# EAGLE design Eagle_TouchSensor (EAGLE 7.2.0)
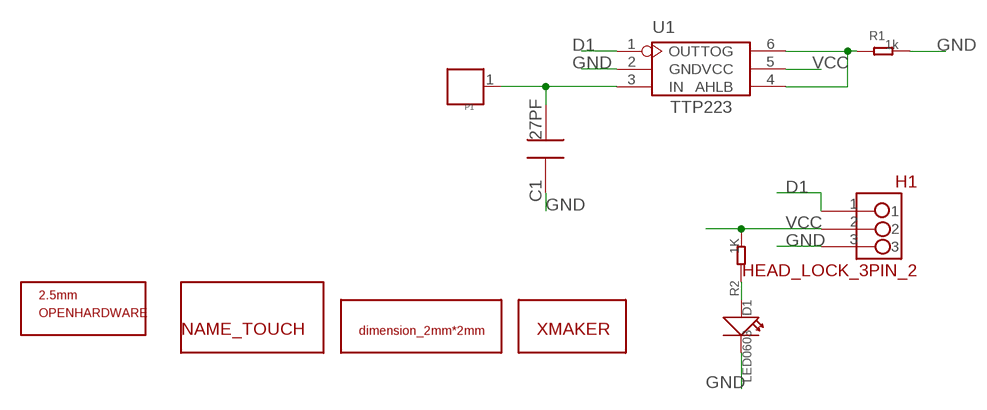
[diagram p0: schematic, sheet 1]

## Parts
C1  27PF  C0603  [0603]
D1  LED0603  [LED0603]
H1  HEAD_LOCK_3PIN_2  [HEAD_LOCK_3PIN_2]
P1  PAD'D450MIL'  [1P-D450]
R1  1k  R0603  [0603]
R2  1K  R0603  [0603]
U1  TTP223  [SOT23-6L]
U$1  XMAKERLOGO  [XMAKERLOGO]
U$3  DIMENSION_2MM2MM  [DIMENSION_2MM*2MM]
U$4  NAME_TOUCH  [NAME_TOUCH]
U$5  OPENHARDWARE_2.5MM_TOP  [OPENSOURCELOGO_2.5MM]

## Nets
D1: H1.1 U1.1(OUT)
GND: C1.1 D1.2(-) H1.3 R1.2 U1.2(GND)
IN: C1.2 P1.1 U1.3(IN)
N$2: R1.1 U1.4(AHLB) U1.6(TOG)
N$3: D1.1(+) R2.1
VCC: H1.2 R2.2 U1.5(VCC)

## Notes on the sheet
- TTP223

## Library data of the parts
C1 = CPT_SMD:C0603; C0603: 100N
D1 = CPT_SMD:LED0603
H1 = Xmaker:HEAD_LOCK_3PIN_2
P1 = Discrete:PAD
R1 R2 = CPT_SMD:R0603
U1 = Seeed:TTP223
U$1 = Xmaker_yuhui:XMAKERLOGO
U$3 = Xmaker:DIMENSION_2MM*2MM
U$4 = Xmaker:NAME_TOUCH
U$5 = Xmaker:OPENHARDWARE_2.5MM_TOP

## Board
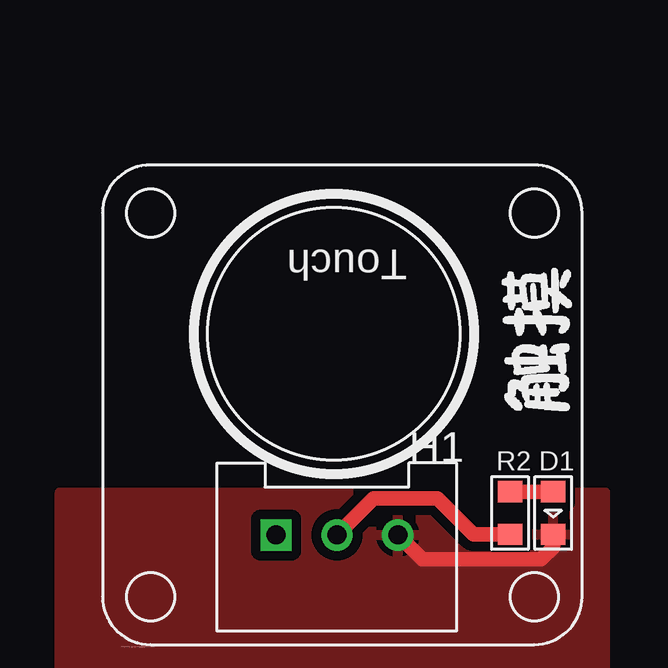
[diagram p1: board, top side]
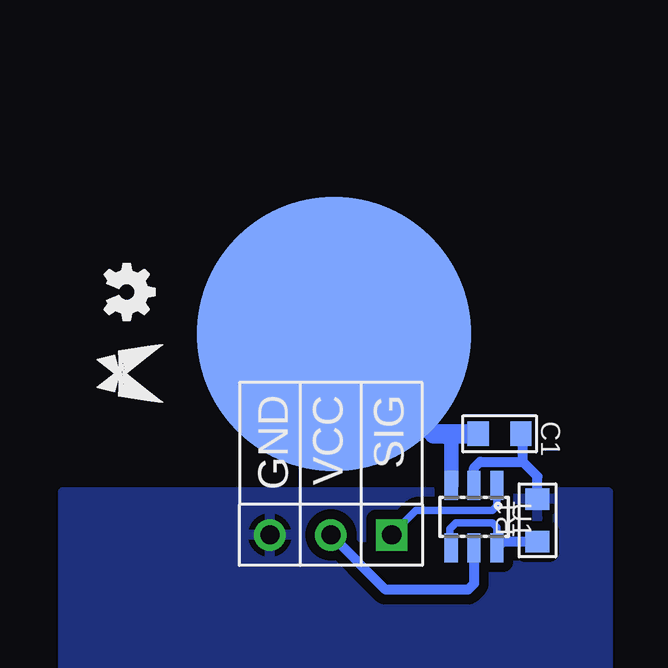
[diagram p2: board, bottom side, seen from below]

No outline drawn. Coordinates in mm, seen from the top.
Copper layers (1*16): Top 0.035mm / dielectric 1.5mm / Bottom 0.035mm
Design rules "SeeedStudio_rule_no_angle_090911": minimum track width 6mil, minimum drill 12mil, track to track 6mil, track to pad 6mil, pad to pad 6mil, via to via 6mil, smd to smd 0mil, copper to edge 10mil, drill to drill 10mil, minimum pad ring 10mil, minimum via ring 6mil, stop-mask expansion 2mil, vias tented up to drill 100mil, thermal gap 10mil

### Footprints (pad centres in the part's own frame; a part is rotated, then mirrored left to right if it is on the bottom)
0603 = smd 0.889 x 1.016: 1 -0.889,0; 2 0.889,0
LED0603 = smd 0.889 x 1.016: 1 -0.889,0; 2 0.889,0
HEAD_LOCK_3PIN_2 = drill 0.8 square: 1 0,2.54 | drill 0.8: 2 0,0; 3 0,-2.54
1P-D450 = smd 11.43 x 11.43: 1 0,0
SOT23-6L = smd 0.55 x 1.2: 1 -0.95,-1.3; 2 0,-1.3; 3 0.95,-1.3; 4 0.95,1.3; 5 0,1.3; 6 -0.95,1.3

### Placement (x,y rotation side)
C1  1.98,8.79 180 bottom
D1  18.03,5.49 270 top
H1  9.02,4.57 90 top
P1  8.89,12.95 0 bottom
R1  0.41,5.18 90 bottom
R2  16.23,5.49 270 top
U1  3.05,5.33 180 bottom
U$1  19.3,13.21 270 bottom
U$3  -0.76,0 0 top
U$4  19.05,12.7 90 top
U$5  17.53,14.73 270 bottom

### Tracks (layer width: path | path; a pad name or v marks a point on that pad's centre or on a via)
D1
  Bottom 0.305: U1.1 2.1,5.78 2.29,5.59 5.46,5.59 H1.1
GND
  Top 0.61: D1.2 18.03,4.06 17.53,3.56 12.57,3.56 H1.3
  Bottom 0.406: R1.2 0.41,7.01 1.02,7.62 | 1.02,7.62 1.02,8.71 C1.1 | U1.2 3.05,7.37 2.79,7.62 1.02,7.62
  pour Bottom (isolate 0.406): -2.54,6.35 20.19,6.35 20.19,-2.79 -2.54,-2.79
  pour Top (isolate 0.406): -2.54,6.35 20.19,6.35 20.19,-2.92 -2.54,-2.92
IN
  Bottom 0.61: U1.3 4,8.47 4.32,8.79
  Bottom 0.813: C1.2 4.32,8.79 4.72,8.79 P1.1
N$2
  Bottom 0.305: U1.6 2.1,4.89 2.29,5.08 3.81,5.08 4.06,4.83 4.06,4.1 U1.4
  Bottom 0.406: R1.1 1.84,4.29 U1.6
N$3
  Top 0.61: R2.1 D1.1
VCC
  Top 0.61: R2.2 14.71,4.6 13.21,6.1 10.54,6.1 H1.2
  Bottom 0.406: U1.5 3.05,2.54 3.3,2.29 6.73,2.29 H1.2

### Text on the board
tPlace: Touch | C:/Users/Xiangzi/Desktop/Ãû³Æ/touch.bmp